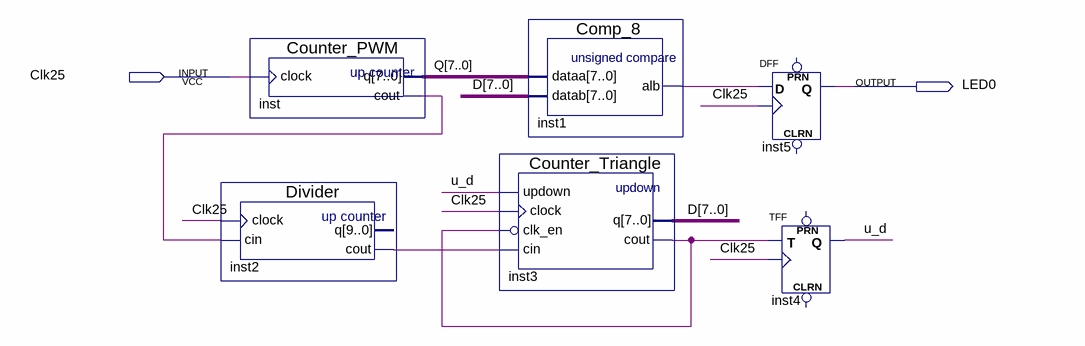
[diagram p0: schematic sheet]
// Quartus schematic Lab_3_2.bdf as structural Verilog: 6 symbols, 2 pins
module Lab_3_2 (
  input  Clk25,
  output LED0
);

  wire inst1_alb, inst2_cout, inst3_cout, inst_cout, u_d;
  wire [7:0] D, Q;

  Counter_PWM inst (.clock(Clk25), .cout(inst_cout), .q(Q));
  Divider inst2 (.clock(Clk25), .cin(inst_cout), .cout(inst2_cout));  // open: q
  Counter_Triangle inst3 (
    .updown(u_d), .clock(Clk25), .clk_en(~inst3_cout), .cin(inst2_cout), .cout(inst3_cout), .q(D));
  Comp_8 inst1 (.dataa(Q), .datab(D), .alb(inst1_alb));
  DFF inst5 (.CLK(Clk25), .D(inst1_alb), .Q(LED0));  // open: CLRN, PRN
  TFF inst4 (.T(inst3_cout), .CLK(Clk25), .Q(u_d));  // open: PRN, CLRN
endmodule
